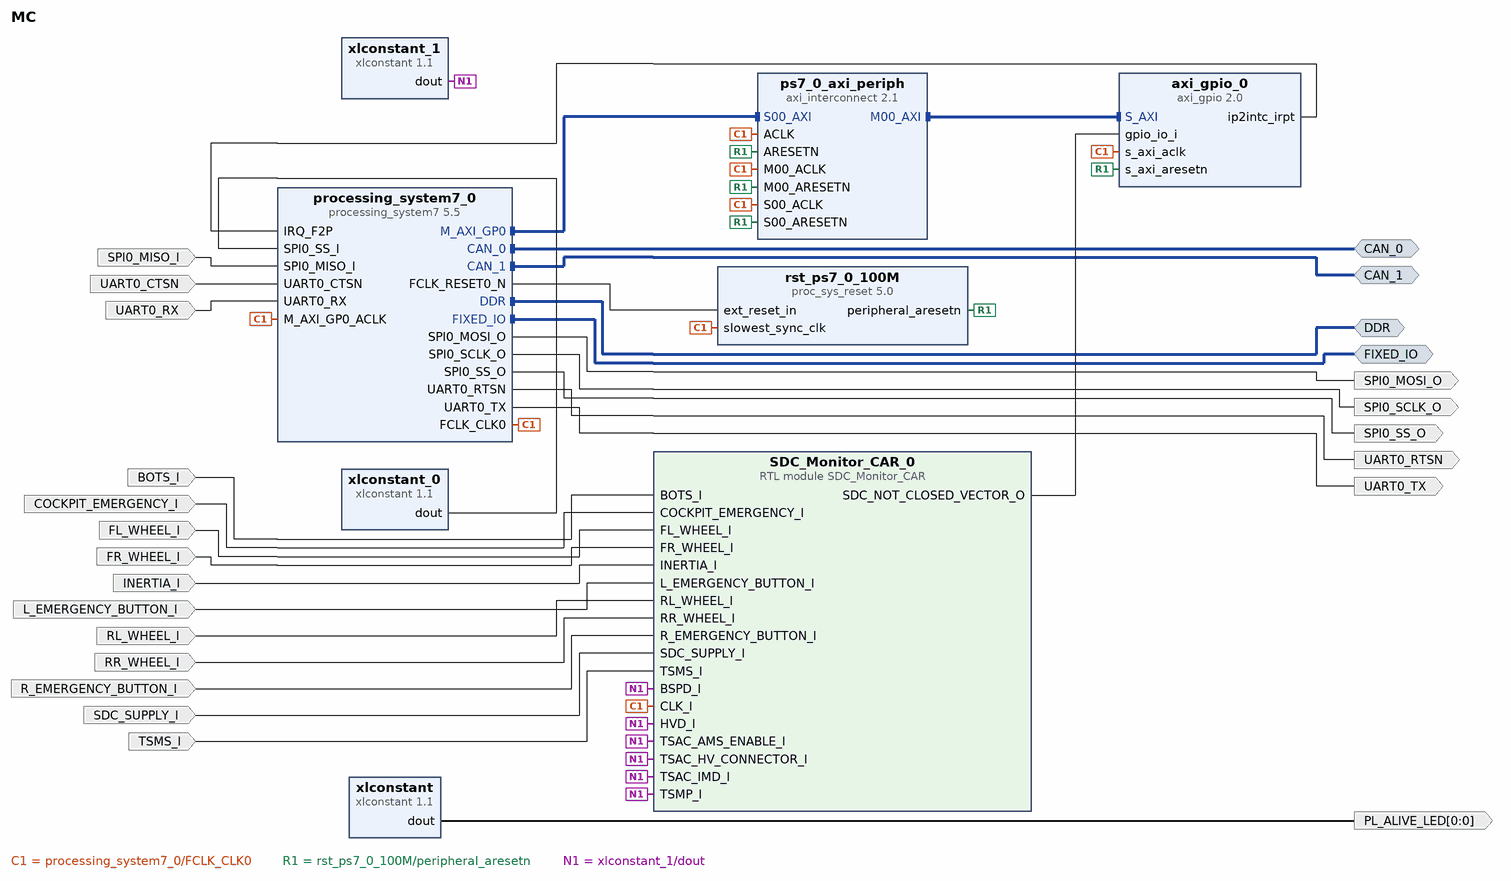
[diagram p0: block diagram of the top level]
# Vivado block design MC, xc7z020clg400-1, Vivado 2024.1
create_bd_design MC

create_bd_intf_port -mode Master -vlnv xilinx.com:interface:ddrx_rtl:1.0 DDR
create_bd_intf_port -mode Master -vlnv xilinx.com:display_processing_system7:fixedio_rtl:1.0 FIXED_IO
create_bd_intf_port -mode Master -vlnv xilinx.com:interface:can_rtl:1.0 CAN_0
create_bd_intf_port -mode Master -vlnv xilinx.com:interface:can_rtl:1.0 CAN_1
create_bd_port -dir O UART0_RTSN
create_bd_port -dir O UART0_TX
create_bd_port -dir I UART0_CTSN
create_bd_port -dir I UART0_RX
create_bd_port -dir O SPI0_SCLK_O
create_bd_port -dir O SPI0_MOSI_O
create_bd_port -dir I SPI0_MISO_I
create_bd_port -dir O SPI0_SS_O
create_bd_port -dir I SDC_SUPPLY_I
create_bd_port -dir I COCKPIT_EMERGENCY_I
create_bd_port -dir I BOTS_I
create_bd_port -dir I L_EMERGENCY_BUTTON_I
create_bd_port -dir I INERTIA_I
create_bd_port -dir I R_EMERGENCY_BUTTON_I
create_bd_port -dir I RL_WHEEL_I
create_bd_port -dir I FR_WHEEL_I
create_bd_port -dir I FL_WHEEL_I
create_bd_port -dir I RR_WHEEL_I
create_bd_port -dir I TSMS_I
create_bd_port -dir O -from 0 -to 0 PL_ALIVE_LED

create_bd_cell -type ip -vlnv xilinx.com:ip:processing_system7:5.5 processing_system7_0
set_property -dict [list \
  CONFIG.PCW_APU_PERIPHERAL_FREQMHZ 667 \
  CONFIG.PCW_CAN0_CAN0_IO EMIO \
  CONFIG.PCW_CAN0_PERIPHERAL_ENABLE 1 \
  CONFIG.PCW_CAN1_CAN1_IO EMIO \
  CONFIG.PCW_CAN1_PERIPHERAL_ENABLE 1 \
  CONFIG.PCW_CAN_PERIPHERAL_CLKSRC {ARM PLL} \
  CONFIG.PCW_CAN_PERIPHERAL_FREQMHZ 24 \
  CONFIG.PCW_ENET0_ENET0_IO {MIO 16 .. 27} \
  CONFIG.PCW_ENET0_GRP_MDIO_ENABLE 1 \
  CONFIG.PCW_ENET0_GRP_MDIO_IO {MIO 52 .. 53} \
  CONFIG.PCW_ENET0_PERIPHERAL_ENABLE 1 \
  CONFIG.PCW_ENET_RESET_ENABLE 0 \
  CONFIG.PCW_FPGA0_PERIPHERAL_FREQMHZ 100 \
  CONFIG.PCW_FPGA1_PERIPHERAL_FREQMHZ 100 \
  CONFIG.PCW_FPGA2_PERIPHERAL_FREQMHZ 33.333333 \
  CONFIG.PCW_GPIO_MIO_GPIO_ENABLE 1 \
  CONFIG.PCW_GPIO_MIO_GPIO_IO MIO \
  CONFIG.PCW_GPIO_PERIPHERAL_ENABLE 1 \
  CONFIG.PCW_I2C_RESET_ENABLE 0 \
  CONFIG.PCW_IRQ_F2P_INTR 1 \
  CONFIG.PCW_PRESET_BANK1_VOLTAGE {LVCMOS 1.8V} \
  CONFIG.PCW_QSPI_GRP_FBCLK_ENABLE 1 \
  CONFIG.PCW_QSPI_GRP_FBCLK_IO {MIO 8} \
  CONFIG.PCW_QSPI_GRP_SINGLE_SS_ENABLE 1 \
  CONFIG.PCW_QSPI_GRP_SINGLE_SS_IO {MIO 1 .. 6} \
  CONFIG.PCW_QSPI_PERIPHERAL_ENABLE 1 \
  CONFIG.PCW_QSPI_QSPI_IO {MIO 1 .. 6} \
  CONFIG.PCW_SD0_PERIPHERAL_ENABLE 0 \
  CONFIG.PCW_SD1_PERIPHERAL_ENABLE 1 \
  CONFIG.PCW_SD1_SD1_IO {MIO 10 .. 15} \
  CONFIG.PCW_SDIO_PERIPHERAL_FREQMHZ 25 \
  CONFIG.PCW_SINGLE_QSPI_DATA_MODE x4 \
  CONFIG.PCW_SPI0_PERIPHERAL_ENABLE 1 \
  CONFIG.PCW_SPI0_SPI0_IO EMIO \
  CONFIG.PCW_TTC0_PERIPHERAL_ENABLE 1 \
  CONFIG.PCW_TTC0_TTC0_IO EMIO \
  CONFIG.PCW_UART0_GRP_FULL_ENABLE 1 \
  CONFIG.PCW_UART0_GRP_FULL_IO EMIO \
  CONFIG.PCW_UART0_PERIPHERAL_ENABLE 1 \
  CONFIG.PCW_UART0_UART0_IO EMIO \
  CONFIG.PCW_UART1_PERIPHERAL_ENABLE 0 \
  CONFIG.PCW_UART_PERIPHERAL_FREQMHZ 50 \
  CONFIG.PCW_UIPARAM_DDR_MEMORY_TYPE {DDR 3 (Low Voltage)} \
  CONFIG.PCW_UIPARAM_DDR_PARTNO {MT41K256M16 RE-125} \
  CONFIG.PCW_USB0_PERIPHERAL_ENABLE 0 \
  CONFIG.PCW_USB_RESET_ENABLE 0 \
  CONFIG.PCW_USE_FABRIC_INTERRUPT 1 \
] [get_bd_cells processing_system7_0]
# 294 more settings of processing_system7_0 are not shown: defaults, MIO pin electricals, DDR timing, and values the tool derives
create_bd_cell -type ip -vlnv xilinx.com:ip:axi_gpio:2.0 axi_gpio_0
set_property -dict [list \
  CONFIG.C_ALL_INPUTS 1 \
  CONFIG.C_GPIO_WIDTH 17 \
  CONFIG.C_INTERRUPT_PRESENT 1 \
  CONFIG.C_IS_DUAL 0 \
] [get_bd_cells axi_gpio_0]
create_bd_cell -type ip -vlnv xilinx.com:ip:axi_interconnect:2.1 ps7_0_axi_periph
set_property -dict {CONFIG.NUM_MI 1} [get_bd_cells ps7_0_axi_periph]
create_bd_cell -type ip -vlnv xilinx.com:ip:proc_sys_reset:5.0 rst_ps7_0_100M
create_bd_cell -type ip -vlnv xilinx.com:ip:xlconstant:1.1 xlconstant_0
create_bd_cell -type module -reference SDC_Monitor_CAR SDC_Monitor_CAR_0
set_property -dict {CONFIG.ClK_divider 10000000} [get_bd_cells SDC_Monitor_CAR_0]
create_bd_cell -type ip -vlnv xilinx.com:ip:xlconstant:1.1 xlconstant_1
set_property -dict {CONFIG.CONST_VAL 0} [get_bd_cells xlconstant_1]
create_bd_cell -type ip -vlnv xilinx.com:ip:xlconstant:1.1 xlconstant

# ---- connections ----

connect_bd_intf_net [get_bd_intf_ports CAN_0] [get_bd_intf_pins processing_system7_0/CAN_0]
connect_bd_intf_net [get_bd_intf_ports CAN_1] [get_bd_intf_pins processing_system7_0/CAN_1]
connect_bd_intf_net [get_bd_intf_ports DDR] [get_bd_intf_pins processing_system7_0/DDR]
connect_bd_intf_net [get_bd_intf_ports FIXED_IO] [get_bd_intf_pins processing_system7_0/FIXED_IO]
connect_bd_intf_net [get_bd_intf_pins processing_system7_0/M_AXI_GP0] [get_bd_intf_pins ps7_0_axi_periph/S00_AXI]
connect_bd_intf_net [get_bd_intf_pins ps7_0_axi_periph/M00_AXI] [get_bd_intf_pins axi_gpio_0/S_AXI]
connect_bd_net -net BOTS_I_0_1 [get_bd_ports BOTS_I] [get_bd_pins SDC_Monitor_CAR_0/BOTS_I]
connect_bd_net -net COCKPIT_EMERGENCY_I_0_1 [get_bd_ports COCKPIT_EMERGENCY_I] [get_bd_pins SDC_Monitor_CAR_0/COCKPIT_EMERGENCY_I]
connect_bd_net -net FL_WHEEL_I_0_1 [get_bd_ports FL_WHEEL_I] [get_bd_pins SDC_Monitor_CAR_0/FL_WHEEL_I]
connect_bd_net -net FR_WHEEL_I_0_1 [get_bd_ports FR_WHEEL_I] [get_bd_pins SDC_Monitor_CAR_0/FR_WHEEL_I]
connect_bd_net -net INERTIA_I_0_1 [get_bd_ports INERTIA_I] [get_bd_pins SDC_Monitor_CAR_0/INERTIA_I]
connect_bd_net -net L_EMERGENCY_BUTTON_I_0_1 [get_bd_ports L_EMERGENCY_BUTTON_I] [get_bd_pins SDC_Monitor_CAR_0/L_EMERGENCY_BUTTON_I]
connect_bd_net -net RL_WHEEL_I_0_1 [get_bd_ports RL_WHEEL_I] [get_bd_pins SDC_Monitor_CAR_0/RL_WHEEL_I]
connect_bd_net -net RR_WHEEL_I_0_1 [get_bd_ports RR_WHEEL_I] [get_bd_pins SDC_Monitor_CAR_0/RR_WHEEL_I]
connect_bd_net -net R_EMERGENCY_BUTTON_I_0_1 [get_bd_ports R_EMERGENCY_BUTTON_I] [get_bd_pins SDC_Monitor_CAR_0/R_EMERGENCY_BUTTON_I]
connect_bd_net -net SDC_Monitor_CAR_0_SDC_VECTOR_O [get_bd_pins SDC_Monitor_CAR_0/SDC_NOT_CLOSED_VECTOR_O] [get_bd_pins axi_gpio_0/gpio_io_i]
connect_bd_net -net SDC_SUPPLY_I_0_1 [get_bd_ports SDC_SUPPLY_I] [get_bd_pins SDC_Monitor_CAR_0/SDC_SUPPLY_I]
connect_bd_net -net SPI0_MISO_I_0_1 [get_bd_ports SPI0_MISO_I] [get_bd_pins processing_system7_0/SPI0_MISO_I]
connect_bd_net -net TSMS_I_0_1 [get_bd_ports TSMS_I] [get_bd_pins SDC_Monitor_CAR_0/TSMS_I]
connect_bd_net -net UART0_CTSN_0_1 [get_bd_ports UART0_CTSN] [get_bd_pins processing_system7_0/UART0_CTSN]
connect_bd_net -net UART0_RX_0_1 [get_bd_ports UART0_RX] [get_bd_pins processing_system7_0/UART0_RX]
connect_bd_net [get_bd_pins axi_gpio_0/ip2intc_irpt] [get_bd_pins processing_system7_0/IRQ_F2P]
connect_bd_net [get_bd_pins processing_system7_0/FCLK_CLK0] \
  [get_bd_pins processing_system7_0/M_AXI_GP0_ACLK] [get_bd_pins ps7_0_axi_periph/S00_ACLK] \
  [get_bd_pins rst_ps7_0_100M/slowest_sync_clk] [get_bd_pins axi_gpio_0/s_axi_aclk] [get_bd_pins ps7_0_axi_periph/M00_ACLK] \
  [get_bd_pins ps7_0_axi_periph/ACLK] [get_bd_pins SDC_Monitor_CAR_0/CLK_I]
connect_bd_net [get_bd_pins processing_system7_0/FCLK_RESET0_N] [get_bd_pins rst_ps7_0_100M/ext_reset_in]
connect_bd_net [get_bd_pins processing_system7_0/SPI0_MOSI_O] [get_bd_ports SPI0_MOSI_O]
connect_bd_net [get_bd_pins processing_system7_0/SPI0_SCLK_O] [get_bd_ports SPI0_SCLK_O]
connect_bd_net [get_bd_pins processing_system7_0/SPI0_SS_O] [get_bd_ports SPI0_SS_O]
connect_bd_net [get_bd_pins processing_system7_0/UART0_RTSN] [get_bd_ports UART0_RTSN]
connect_bd_net [get_bd_pins processing_system7_0/UART0_TX] [get_bd_ports UART0_TX]
connect_bd_net [get_bd_pins rst_ps7_0_100M/peripheral_aresetn] \
  [get_bd_pins ps7_0_axi_periph/S00_ARESETN] [get_bd_pins axi_gpio_0/s_axi_aresetn] \
  [get_bd_pins ps7_0_axi_periph/M00_ARESETN] [get_bd_pins ps7_0_axi_periph/ARESETN]
connect_bd_net [get_bd_pins xlconstant_0/dout] [get_bd_pins processing_system7_0/SPI0_SS_I]
connect_bd_net [get_bd_pins xlconstant_1/dout] \
  [get_bd_pins SDC_Monitor_CAR_0/TSAC_HV_CONNECTOR_I] [get_bd_pins SDC_Monitor_CAR_0/TSAC_IMD_I] \
  [get_bd_pins SDC_Monitor_CAR_0/TSAC_AMS_ENABLE_I] [get_bd_pins SDC_Monitor_CAR_0/BSPD_I] \
  [get_bd_pins SDC_Monitor_CAR_0/HVD_I] [get_bd_pins SDC_Monitor_CAR_0/TSMP_I]
connect_bd_net -net xlconstant_2_dout [get_bd_pins xlconstant/dout] [get_bd_ports PL_ALIVE_LED]

# ---- address map ----
assign_bd_address -offset 0x41200000 -range 64K -target_address_space [get_bd_addr_spaces processing_system7_0/Data] [get_bd_addr_segs axi_gpio_0/S_AXI/Reg]

set_property USER_COMMENTS.comment_0 {BSPD_I, TSMP_I, HVD_I are not included on the PCB. Must be added in a future edition} [current_bd_design]

validate_bd_design
save_bd_design
